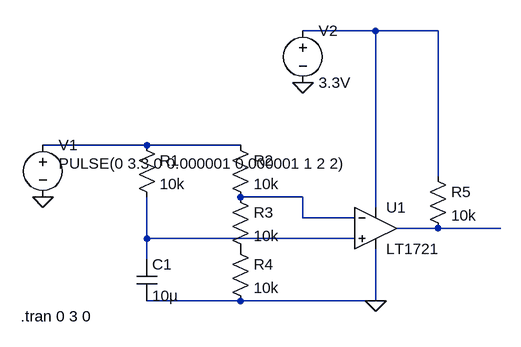
[diagram p0: schematic Capacitance meter.asc]
Capacitance meter.asc, the LTspice schematic file:
Version 4
SHEET 1 880 680
WIRE 448 -96 336 -96
WIRE 544 -96 448 -96
WIRE 96 80 -64 80
WIRE 240 80 96 80
WIRE 544 128 544 -96
WIRE 336 160 240 160
WIRE 448 176 448 -96
WIRE 336 192 336 160
WIRE 416 192 336 192
WIRE 544 208 480 208
WIRE 640 208 544 208
WIRE 96 224 96 160
WIRE 416 224 96 224
WIRE 96 256 96 224
WIRE 240 320 96 320
WIRE 448 320 448 240
WIRE 448 320 240 320
FLAG 336 -16 0
FLAG -64 160 0
FLAG 448 320 0
SYMBOL cap 80 256 R0
SYMATTR InstName C1
SYMATTR Value 10µ
SYMBOL res 80 64 R0
SYMATTR InstName R1
SYMATTR Value 10k
SYMBOL res 224 64 R0
SYMATTR InstName R2
SYMATTR Value 10k
SYMBOL res 224 144 R0
SYMATTR InstName R3
SYMATTR Value 10k
SYMBOL res 224 224 R0
SYMATTR InstName R4
SYMATTR Value 10k
SYMBOL voltage -64 64 R0
WINDOW 3 24 44 Left 2
WINDOW 123 0 0 Left 0
WINDOW 39 0 0 Left 0
SYMATTR InstName V1
SYMATTR Value PULSE(0 3.3 0 0.000001 0.000001 1 2 2)
SYMBOL Comparators\\LT1721 448 144 R0
SYMATTR InstName U1
SYMBOL res 528 112 R0
SYMATTR InstName R5
SYMATTR Value 10k
SYMBOL voltage 336 -112 R0
WINDOW 123 0 0 Left 0
WINDOW 39 0 0 Left 0
SYMATTR InstName V2
SYMATTR Value 3.3V
TEXT -98 344 Left 2 !.tran 0 3 0

The netlist it stands for:
* Capacitance meter.asc
C1 N005 0 10µ
R1 N002 N005 10k
R2 N002 N003 10k
R3 N003 P001 10k
R4 P001 0 10k
V1 N002 0 PULSE(0 3.3 0 0.000001 0.000001 1 2 2)
XU1 N005 N003 N001 0 N004 LT1720  ; LT1721, pins In+ In- V+ V- OUT
R5 N001 N004 10k
V2 N001 0 3.3V
.tran 0 3 0
.lib LTC.lib
.backanno
.end